# Altium project ESP32-Antenna-NoPackage.PrjPcb
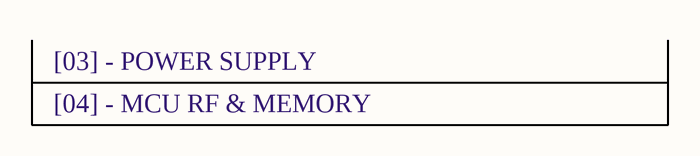
[diagram p0: COVER PAGE.SchDoc]
4 sheets, 43 parts. Net scope: global (net labels, ports and power ports of the same name join across sheets).
Board file: ESP32_Board.PcbDoc
Sheets:
  COVER PAGE.SchDoc
  BLOCK DIAGRAM.SchDoc
  POWER SUPPLY.SchDoc
  MCU RF & MEMORY.SchDoc

## Sheet COVER PAGE.SchDoc
size A3; Date: 12/09/2026; Author: J. Villodres; DrawnBy: Juan Alejandro Villodres Perdomo; DocumentNumber: 1; Revision: 0.1; SheetNumber: 1; SheetTotal: 4; ProjectDescription: Development board with custom ESP32-C3 SoC and no RF shielding.; github: https://github.com/jvillodres/pcb-designs

### Notes on the sheet
- [03] - POWER SUPPLY
- [04] - MCU RF & MEMORY
- Designator Format (XPNN):
- DESIGN CONSIDERATIONS:
- TABLE OF CONTENTS:
- X: Standard Designator
- P: Page Number
- N: Device Number
- Sheet Name:
- More Projects <https://github.com/jvillodres/pcb-designs>
- [01] - COVER PAGE
- [02] - BLOCK DIAGRAM
- Project Name:
- Sheet Title:
- Project Description:
- Doc. num:
- Designer:
- Date initialized:
- Last modified:
- Version:
- Size:
- A3
- Sheet:
- Of

## Sheet BLOCK DIAGRAM.SchDoc
size A3; Date: 12/09/2026; DrawnBy: Juan Alejandro Villodres Perdomo; Revision: 1.0; SheetNumber: 2; SheetTotal: 4; SheetDescription: A simplified block diagram made with hierachical blocks for system description.
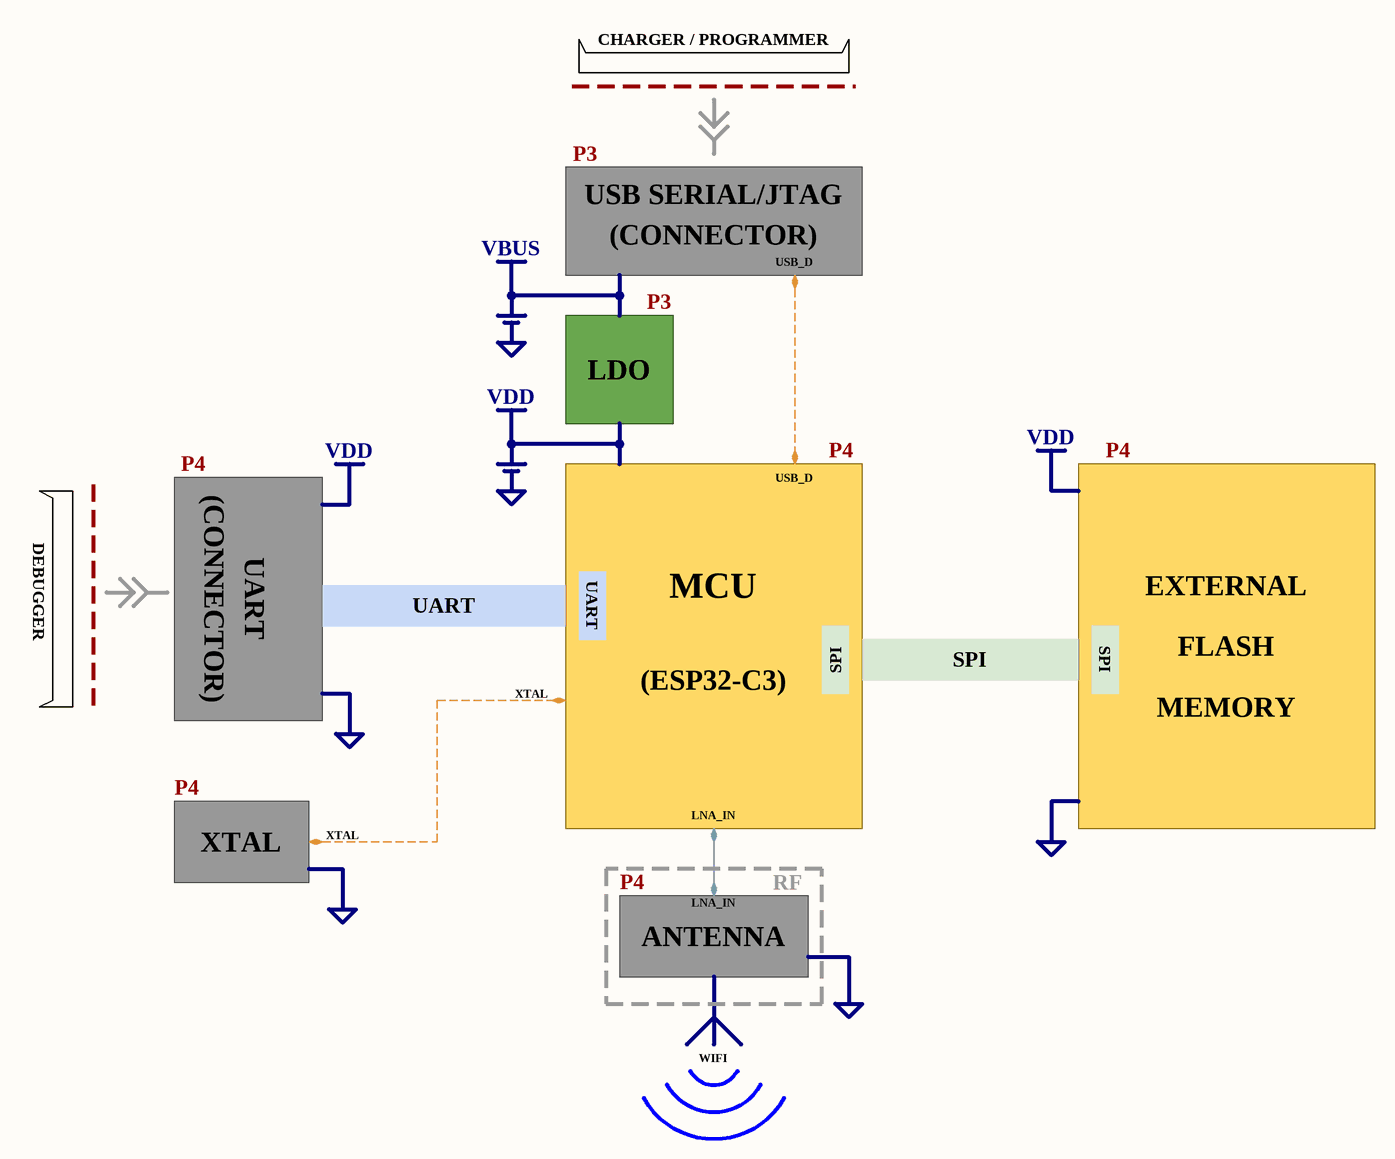
[diagram p1: BLOCK DIAGRAM.SchDoc]

### Notes on the sheet
- CHARGER / PROGRAMMER
- P3
- USB SERIAL/JTAG
- (CONNECTOR)
- VBUS
- USB_D
- LDO
- VDD
- P4
- DEBUGGER
- UART
- MCU
- EXTERNAL
- XTAL
- (ESP32-C3)
- SPI
- FLASH
- MEMORY
- LNA_IN
- RF
- ANTENNA
- WIFI
- Project Name:
- Sheet Description:
- CONNECTIONS
- PX
- BLOCKS
- BUSES
- Sheet Title:
- PWR
- SIG
- POWER - IC
- DIGITAL - IC
- ANALOG - IC
- DISCRETE
- Designer:
- DIFF. PAIR
- PX - PAGE NUMBER
- ISOLATED
- Date initialized:
- Last modified:
- Version:
- Size:
- A3
- Sheet:
- Of

## Sheet POWER SUPPLY.SchDoc
size A4; Date: 12/09/2026; DrawnBy: Juan Alejandro Villodres Perdomo; Revision: 1.0; SheetNumber: 3; SheetTotal: 4; SheetDescription: USB connector for programming and power supply with Low Drop-Out regulator.
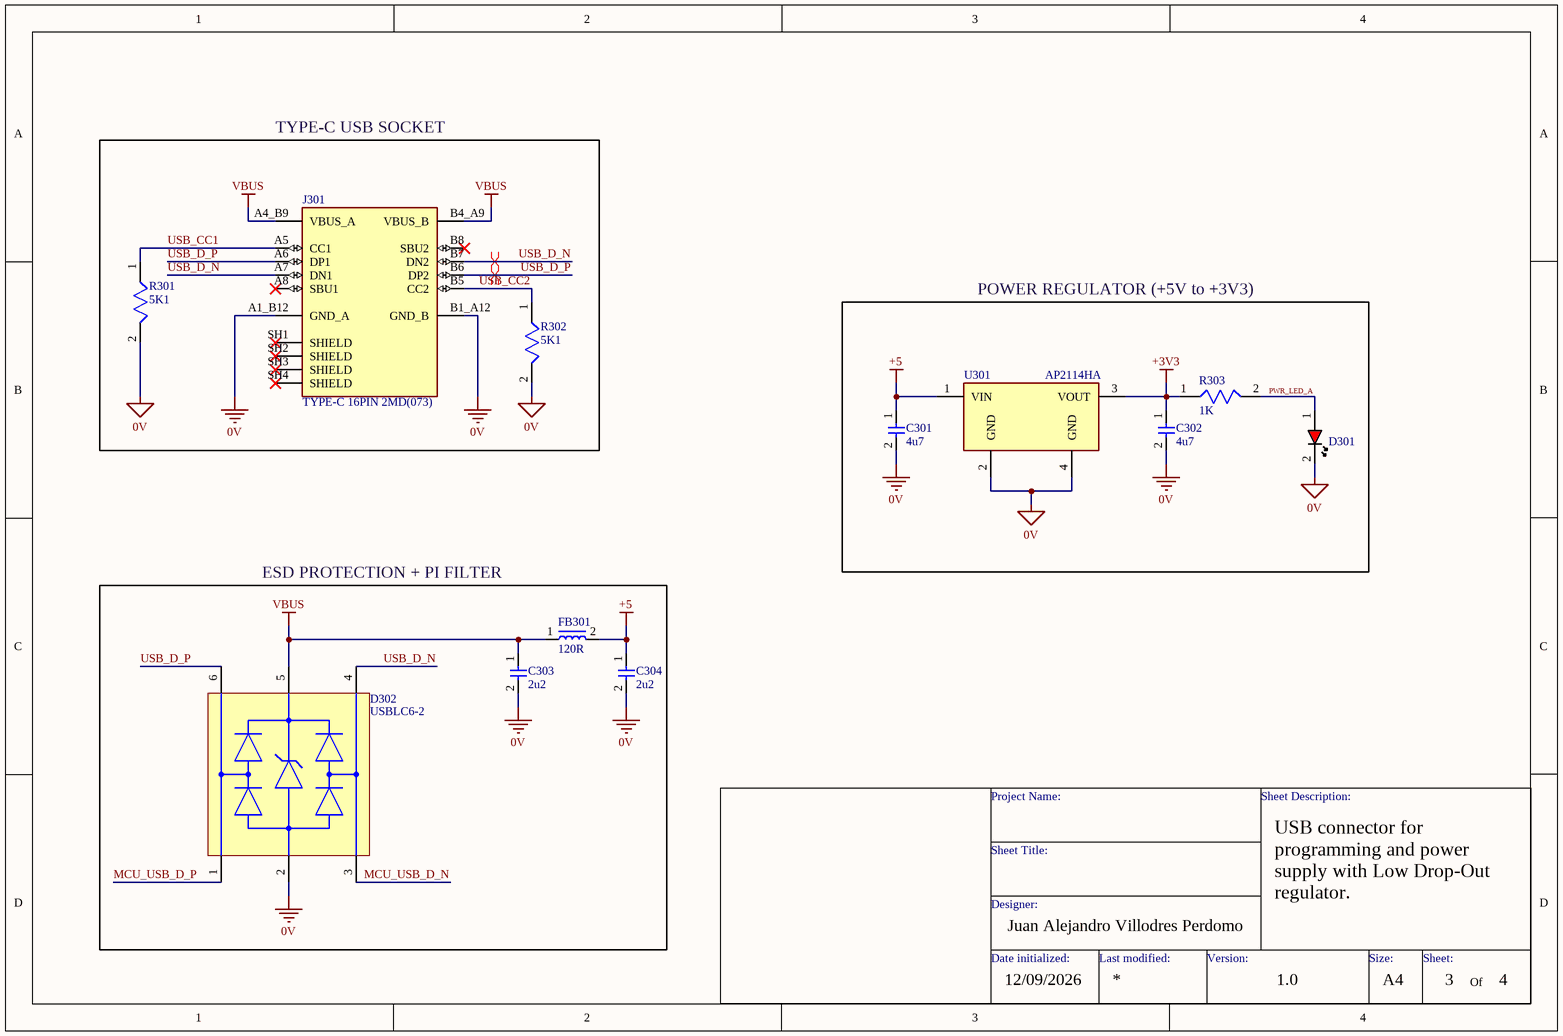
[diagram p2: POWER SUPPLY.SchDoc]

### Parts
C301  4u7  [CAPC1608X90N]
C302  4u7  [CAPC1608X90N]
C303  2u2  [CAPC1608X90N]
C304  2u2  [CAPC1608X90N]
D301  LED_0402_RED  [LEDC0402]  (value not drawn)
D302  USBLC6-2  [SOT95P280X145-6N]
FB301  120R  [FBC1608X95N]
J301  TYPE-C 16PIN 2MD(073)  [SHOUHAN_TYPE-C_16PIN_2MD_(073)]
R301  5K1  [RESC1005X37N]
R302  5K1  [RESC1005X37N]
R303  1K  [RESC1005X37N]
U301  AP2114HA  [SOT230P700X180-4N]

### Blocks framed on the sheet
TYPE-C USB SOCKET: J301 R301 R302
POWER REGULATOR (+5V to +3V3): C301 C302 D301 R303 U301
ESD PROTECTION + PI FILTER: C303 C304 D302 FB301

### Nets
0V: C301.2 C302.2 C303.2 C304.2 D301.2(K) D302.2(GND) J301.A1_B12(GND_A) J301.B1_A12(GND_B) R301.2 R302.2 U301.2(GND) U301.4(GND)
+3V3: C302.1 R303.1 U301.3(VOUT)
+5: C301.1 C304.1 FB301.2 U301.1(VIN)
VBUS: C303.1 D302.5(VBUS) FB301.1 J301.A4_B9(VBUS_A) J301.B4_A9(VBUS_B)
MCU_USB_D_N: D302.3(I/O2)
MCU_USB_D_P: D302.1(I/O1)
PWR_LED_A: D301.1(A) R303.2
USB_CC1: J301.A5(CC1) R301.1
USB_CC2: J301.B5(CC2) R302.1
USB_D_N: D302.4(I/O2) J301.A7(DN1) J301.B7(DN2)
USB_D_P: D302.6(I/O1) J301.A6(DP1) J301.B6(DP2)

Not connected (* = marked no-connect by the designer): J301 A8(SBU1)* B8(SBU2)* SH1(SHIELD)* SH2(SHIELD)* SH3(SHIELD)* SH4(SHIELD)*

### Layout directives
differential pair: USB_D_N, USB_D_P

### Notes on the sheet
- Project Name:
- Sheet Description:
- Sheet Title:
- Designer:
- Date initialized:
- Last modified:
- Version:
- Size:
- A4
- Sheet:
- Of

### Library data of the parts
C301-C304 = CAP_0603_16V: Capacitor SMD 0603 16V
D301 = LED_0402_RED: LED RED SMD 0402
D302 = USBLC6-2: -40℃~+125℃ 150nA 17V 2 3.5pF 5.25V 5A 6V ESD IEC 61000-4-2 Unidirectional SOT-23-6L ESD and Surge Protection (TVS/ESD) ROHS
FB301 = FB_0603: Ferrite Bead SMD 0603
J301 = TYPE-C 16PIN 2MD(073): DC-5V 5A Type C USB
R301-R303 = RES_0402: Resistor SMD 0402
U301 = AP2114HA-3.3TRG1: -40℃~+85℃@(Ta) 1 1A 3.3V 30uVrms 65dB@(1kHz) 65uA 6V 750mV@(1A) Fixed Over Current Protection、Thermal Shutdown、使能控制 Positive SOT-223 Voltage Regulators - Linear, Low Drop Out (LDO) Regulators ROHS; Supplier 1: Newark; Supplier Part Number 1: AP2114HA-3.3TRG1

## Sheet MCU RF & MEMORY.SchDoc
size A3; Date: 12/09/2026; DrawnBy: Juan Alejandro Villodres Perdomo; Revision: 1.0; SheetNumber: 4; SheetTotal: 4; SheetDescription: MCU connections with external oscillator, flash memory and RF antenna.
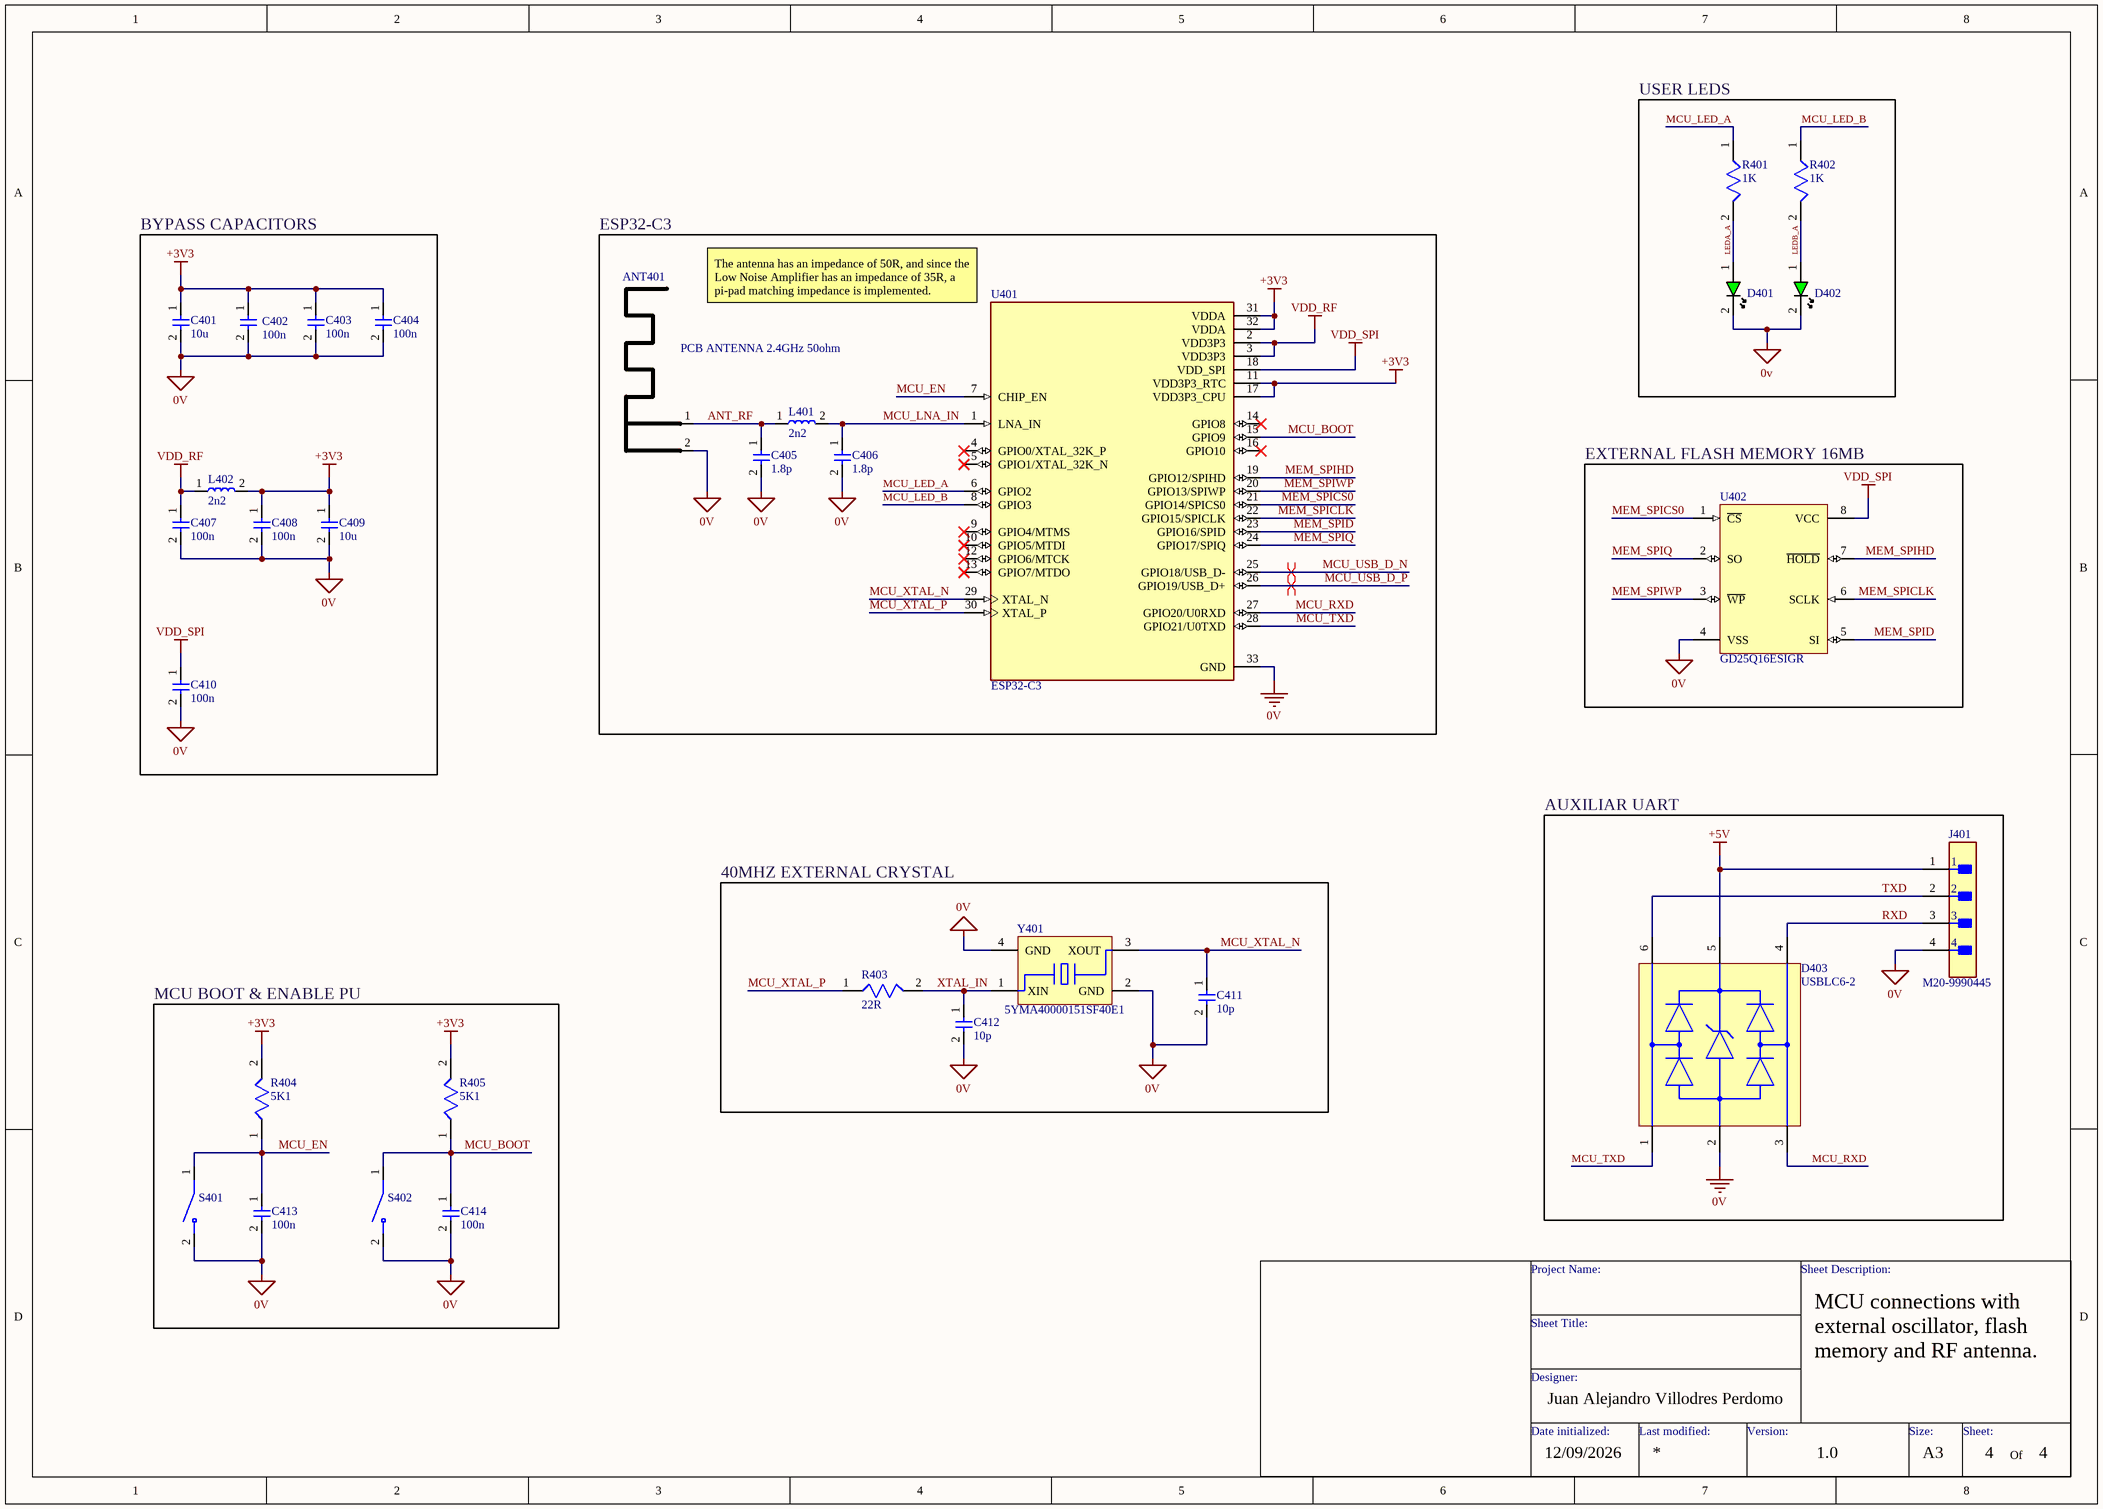
[diagram p3: MCU RF & MEMORY.SchDoc]

### Parts
ANT401  PCB ANTENNA 2.4GHz 50ohm  [ANT_IFA_2_4GHZ_50R]  (no BOM)
C401  10u  [CAPC1608X90N]
C402  100n  [CAPC1005X55N]
C403  100n  [CAPC1005X55N]
C404  100n  [CAPC1005X55N]
C405  1.8p  [CAPC0603X23L]
C406  1.8p  [CAPC0603X23L]
C407  100n  [CAPC1005X55N]
C408  100n  [CAPC1005X55N]
C409  10u  [CAPC1608X90N]
C410  100n  [CAPC1005X55N]
C411  10p  [CAPC1005X55N]
C412  10p  [CAPC1005X55N]
C413  100n  [CAPC1005X55N]
C414  100n  [CAPC1005X55N]
D401  LED_0402_GREEN  [LEDC0402]  (value not drawn)
D402  LED_0402_GREEN  [LEDC0402]  (value not drawn)
D403  USBLC6-2  [SOT95P280X145-6N]
J401  M20-9990445  [FP-M20-9990445-MFG]
L401  2n2  [INDC0603X33L]
L402  2n2  [INDC1005X55N]
R401  1K  [RESC1005X37N]
R402  1K  [RESC1005X37N]
R403  22R  [RESC1005X37N]
R404  5K1  [RESC1608X47N]
R405  5K1  [RESC1608X47N]
S401  TS-1088-AR02016  [SW_TS-1088-AR02016]  (value not drawn)
S402  TS-1088-AR02016  [SW_TS-1088-AR02016]  (value not drawn)
U401  ESP32-C3  [QFN50P500X500X90-33N]
U402  GD25Q16ESIGR  [SOP127P790X216-8N]
Y401  5YMA40000151SF40E1  [XTAL_C3E-16.000-12-1015-R]

### Blocks framed on the sheet
USER LEDS: D401 D402 R401 R402
BYPASS CAPACITORS: C401-C404 C407-C410 L402
ESP32-C3: ANT401 C405 C406 L401 U401
EXTERNAL FLASH MEMORY 16MB: U402
AUXILIAR UART: D403 J401
40MHZ EXTERNAL CRYSTAL: C411 C412 R403 Y401
MCU BOOT & ENABLE PU: C413 C414 R404 R405 S401 S402

### Nets
0V: ANT401.2(GND) C401.2 C402.2 C403.2 C404.2 C405.2 C406.2 C407.2 C408.2 C409.2 C410.2 C411.2 C412.2 C413.2 C414.2 D401.2(K) D402.2(K) D403.2(GND) J401.4 S401.2 S402.2 U401.33(GND) U402.4(VSS) Y401.2(GND) Y401.4(GND)
+3V3: C401.1 C402.1 C403.1 C404.1 C408.1 C409.1 L402.2 R404.2 R405.2 U401.11(VDD3P3_RTC) U401.17(VDD3P3_CPU) U401.31(VDDA) U401.32(VDDA)
+5V: D403.5(VBUS) J401.1
VDD_RF: C407.1 L402.1 U401.2(VDD3P3) U401.3(VDD3P3)
VDD_SPI: C410.1 U401.18(VDD_SPI) U402.8(VCC)
ANT_RF: ANT401.1(RF) C405.1 L401.1
LEDA_A: D401.1(A) R401.2
LEDB_A: D402.1(A) R402.2
MCU_BOOT: C414.1 R405.1 S402.1 U401.15(GPIO9)
MCU_EN: C413.1 R404.1 S401.1 U401.7(CHIP_EN)
MCU_LED_A: R401.1 U401.6(GPIO2)
MCU_LED_B: R402.1 U401.8(GPIO3)
MCU_LNA_IN: C406.1 L401.2 U401.1(LNA_IN)
MCU_RXD: D403.3(I/O2) U401.27(GPIO20/U0RXD)
MCU_TXD: D403.1(I/O1) U401.28(GPIO21/U0TXD)
MCU_USB_D_N: U401.25(GPIO18/USB_D-)
MCU_USB_D_P: U401.26(GPIO19/USB_D+)
MCU_XTAL_N: C411.1 U401.29(XTAL_N) Y401.3(XOUT)
MCU_XTAL_P: R403.1 U401.30(XTAL_P)
MEM_SPICLK: U401.22(GPIO15/SPICLK) U402.6(SCLK)
MEM_SPICS0: U401.21(GPIO14/SPICS0) U402.1(~{CS})
MEM_SPID: U401.23(GPIO16/SPID) U402.5(SI)
MEM_SPIHD: U401.19(GPIO12/SPIHD) U402.7(~{HOLD})
MEM_SPIQ: U401.24(GPIO17/SPIQ) U402.2(SO)
MEM_SPIWP: U401.20(GPIO13/SPIWP) U402.3(~{WP})
RXD: D403.4(I/O2) J401.3
TXD: D403.6(I/O1) J401.2
XTAL_IN: C412.1 R403.2 Y401.1(XIN)

Not connected (* = marked no-connect by the designer): U401 4(GPIO0/XTAL_32K_P)* 5(GPIO1/XTAL_32K_N)* 9(GPIO4/MTMS)* 10(GPIO5/MTDI)* 12(GPIO6/MTCK)* 13(GPIO7/MTDO)* 14(GPIO8)* 16(GPIO10)*

### Layout directives
differential pair: MCU_USB_D_N, MCU_USB_D_P

### Notes on the sheet
- (near U401) The antenna has an impedance of 50R, and since the Low Noise Amplifier has an impedance of 35R, a pi-pad matching impedance is implemented.
- Project Name:
- Sheet Description:
- Sheet Title:
- Designer:
- Date initialized:
- Last modified:
- Version:
- Size:
- A3
- Sheet:
- Of

### Library data of the parts
ANT401 = ANT_IFA_USB_2_4GHZ_50R: Inverted F 2.4GHz ISM PCB Antenna 50 Ohm
C401 C409 = CAP_0603_16V: Capacitor SMD 0603 16V
C402-C404 C407 C408 C410-C414 = CAP_0402_16V: Capacitor SMD 0402 16V
C405 C406 = CAP_0201_16V: Capacitor SMD 0201 16V
D401 D402 = LED_0402_GREEN: LED GREEN SMD 0402
D403 = USBLC6-2: as D302 on sheet POWER SUPPLY
J401 = CMP-00671-05399696-1: M20-9990445 Conn Unshrouded Header HDR 4 POS 2.54mm Solder ST Thru-Hole Bulk/Loose; Insulation Resistance: 10GΩ; Connector Type: Male Pin; Voltage Rating (DC): 750V; Max Current Rating: 3A; Contact Resistance: 25mΩ; Number of Contacts: 4; Gender: Male; Color: Black; Height: 2.54mm; Contact Material: Brass, Bronze, Gold, Nickel; Orientation: Straight; Width: 12.7mm; Mount: Through Hole; Pitch: 2.54mm; Lead Pitch: 2.54mm; RoHS: Compliant; Max Operating Temperature: 105°C; Case/Package: SIL; NexarPartId: 5399696; Depth: 2.54mm; Length: 10.16mm; Current Rating: 3A; Contact Plating: Gold; Radiation Hardening: No; Contact Mating Length: 6.096mm; Voltage Rating (AC): 750V; Termination: Solder; REACH SVHC: No SVHC; Weight: 45.359237g; Number of Rows: 1; Min Operating Temperature: -40°C; Housing Material: Nylon; Housing Color: Black; Number of Positions: 4; Number of Pins: 4
L401 = IND_0201: Inductor SMD 0201
L402 = IND_0402: Inductor SMD 0402
R401-R403 = RES_0402: Resistor SMD 0402
R404 R405 = RES_0603: Resistor SMD 0603
S401 S402 = TS-1088-AR02016: 50mA 4mm 100MÎ© 100,000 Times 12V 160gf 3mm 2mm Round Button Vertical welding SPST SMD Tactile Switches ROHS
U401 = ESP32-C3: WiFi Modules (802.11) (Engineering Samples Only) SMD IC ESP32-C3, RISC-V single-core MCU, 2.4G Wi-Fi & BLE 5.0 combo, QFN 32-pin, 5*5 mm, 40 ~ 105C; Supplier 1: DigiKey; Supplier Part Number 1: 1904-ESP32-C3CT-ND
U402 = GD25Q16ESIGR: 100,000 cycles 11uA 133MHz 150ms@(32KB) 16Mbit 2.7V~3.6V 20 Years 400us SPI SOP-8-208mil NOR FLASH ROHS
Y401 = 5YMA40000151SF40E1: -20℃~+85℃ 15pF 40MHz 40Ω Crystal Oscillator ±10ppm ±10ppm SMD3225-4P Crystals ROHS

## Nets that join several sheets
0V: POWER SUPPLY (12 pins), MCU RF & MEMORY (25 pins)
+3V3: POWER SUPPLY (C302.1 R303.1 U301.3), MCU RF & MEMORY (13 pins)
MCU_USB_D_N: POWER SUPPLY (D302.3), MCU RF & MEMORY (U401.25)
MCU_USB_D_P: POWER SUPPLY (D302.1), MCU RF & MEMORY (U401.26)